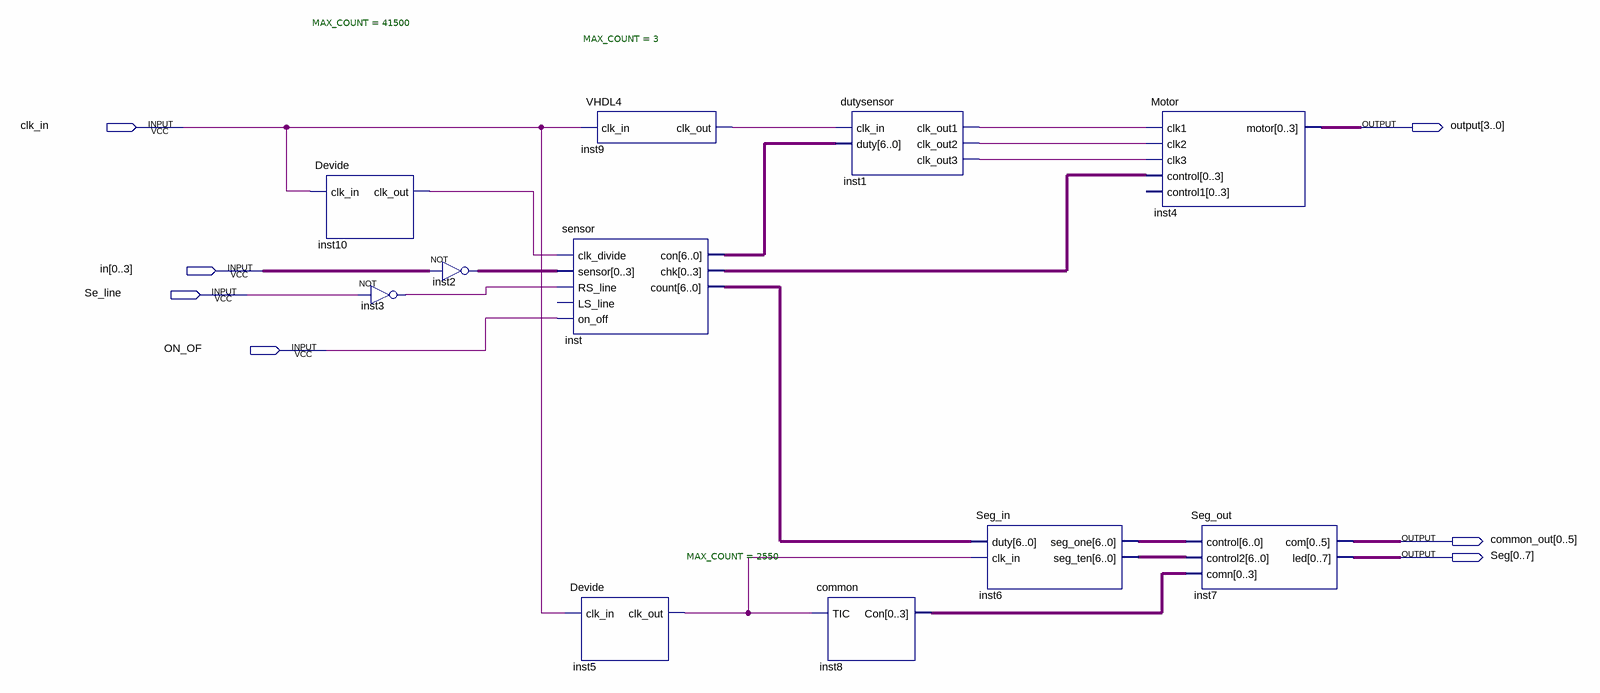
[diagram p0: schematic sheet]
// Quartus schematic VHDL3.bdf as structural Verilog: 11 symbols, 7 pins
module VHDL3 (
  input  clk_in,
  input  [0:3] in,
  input  Se_line,
  input  ON_OF,
  output [3:0] \output ,
  output [0:5] common_out,
  output [0:7] Seg
);

  wire inst1_clk_out1, inst1_clk_out2, inst1_clk_out3, inst3_out, inst5_clk_out, inst9_clk_out,
       inst10_clk_out;
  wire [3:0] inst2_out, inst8_con, inst_chk;
  wire [6:0] inst6_seg_one, inst6_seg_ten, inst_con, inst_count;

  Devide #(.MAX_COUNT(41500)) inst10 (.clk_in(clk_in), .clk_out(inst10_clk_out));
  not inst3 (inst3_out, Se_line);
  assign inst2_out = ~in;  // NOT inst2, 4 bits wide
  VHDL4 #(.MAX_COUNT(3)) inst9 (.clk_in(clk_in), .clk_out(inst9_clk_out));
  sensor inst (
    .clk_divide(inst10_clk_out), .sensor(inst2_out), .RS_line(inst3_out), .on_off(ON_OF), .con(inst_con),
    .chk(inst_chk), .count(inst_count));  // open: LS_line
  Devide #(.MAX_COUNT(2550)) inst5 (.clk_in(clk_in), .clk_out(inst5_clk_out));
  dutysensor inst1 (
    .clk_in(inst9_clk_out), .duty(inst_con), .clk_out1(inst1_clk_out1), .clk_out2(inst1_clk_out2),
    .clk_out3(inst1_clk_out3));
  common inst8 (.TIC(inst5_clk_out), .Con(inst8_con));
  Seg_in inst6 (.duty(inst_count), .clk_in(inst5_clk_out), .seg_one(inst6_seg_one), .seg_ten(inst6_seg_ten));
  Motor inst4 (
    .clk1(inst1_clk_out1), .clk2(inst1_clk_out2), .clk3(inst1_clk_out3), .control(inst_chk), .motor(\output ));  // open: control1
  Seg_out inst7 (.control(inst6_seg_one), .control2(inst6_seg_ten), .comn(inst8_con), .com(common_out), .led(Seg));
endmodule
